# Altium schematic sheet revisies.SchDoc
size A3; ApprovedBy: CdB; CheckedBy: CdB; DrawnBy: RT; Engineer: CdB; Organization: Faber Electronics B.V.; Address1: Th. Dobbeweg 1,; Address2: 6883 GN Velp,; Address3: Netherlands; Address4: T: 026-38 46 800; DocumentNumber: 6; Revision: 2.1.3; SheetNumber: 6; SheetTotal: 6; Status: Final
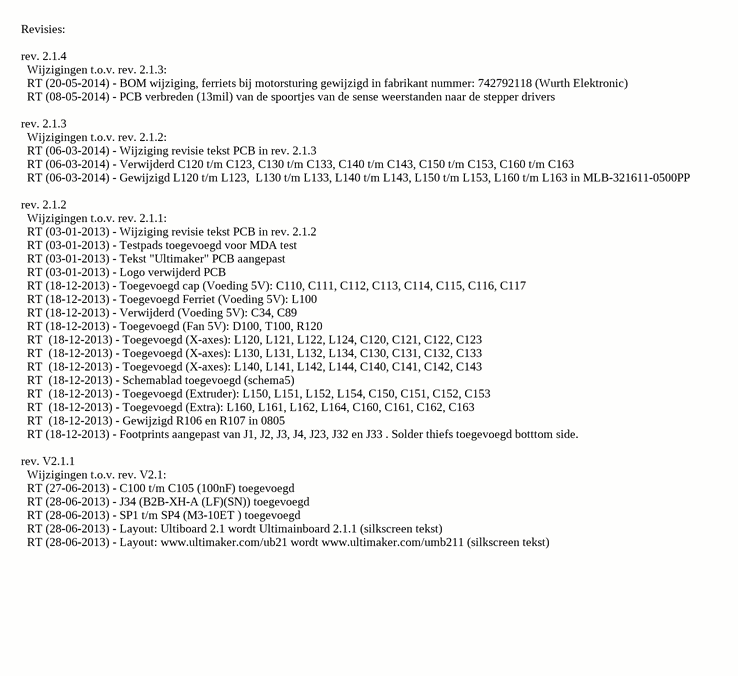
[diagram p0: revisies.SchDoc]

## Notes on the sheet
- Revisies:
  rev. 2.1.4
  Wijzigingen t.o.v. rev. 2.1.3:
  RT (20-05-2014) - BOM wijziging, ferriets bij motorsturing gewijzigd in fabrikant nummer: 742792118 (Wurth Elektronic)
  RT (08-05-2014) - PCB verbreden (13mil) van de spoortjes van de sense weerstanden naar de stepper drivers
  rev. 2.1.3
  Wijzigingen t.o.v. rev. 2.1.2:
  RT (06-03-2014) - Wijziging revisie tekst PCB in rev. 2.1.3
  RT (06-03-2014) - Verwijderd C120 t/m C123, C130 t/m C133, C140 t/m C143, C150 t/m C153, C160 t/m C163
  RT (06-03-2014) - Gewijzigd L120 t/m L123,  L130 t/m L133, L140 t/m L143, L150 t/m L153, L160 t/m L163 in MLB-321611-0500PP
  rev. 2.1.2
  Wijzigingen t.o.v. rev. 2.1.1:
  RT (03-01-2013) - Wijziging revisie tekst PCB in rev. 2.1.2
  RT (03-01-2013) - Testpads toegevoegd voor MDA test
  RT (03-01-2013) - Tekst "Ultimaker" PCB aangepast
  RT (03-01-2013) - Logo verwijderd PCB
  RT (18-12-2013) - Toegevoegd cap (Voeding 5V): C110, C111, C112, C113, C114, C115, C116, C117
  RT (18-12-2013) - Toegevoegd Ferriet (Voeding 5V): L100
  RT (18-12-2013) - Verwijderd (Voeding 5V): C34, C89
  RT (18-12-2013) - Toegevoegd (Fan 5V): D100, T100, R120
  RT  (18-12-2013) - Toegevoegd (X-axes): L120, L121, L122, L124, C120, C121, C122, C123
  RT  (18-12-2013) - Toegevoegd (X-axes): L130, L131, L132, L134, C130, C131, C132, C133
  RT  (18-12-2013) - Toegevoegd (X-axes): L140, L141, L142, L144, C140, C141, C142, C143
  RT  (18-12-2013) - Schemablad toegevoegd (schema5)
  RT  (18-12-2013) - Toegevoegd (Extruder): L150, L151, L152, L154, C150, C151, C152, C153
  RT  (18-12-2013) - Toegevoegd (Extra): L160, L161, L162, L164, C160, C161, C162, C163
  RT  (18-12-2013) - Gewijzigd R106 en R107 in 0805
  RT (18-12-2013) - Footprints aangepast van J1, J2, J3, J4, J23, J32 en J33 . Solder thiefs toegevoegd botttom side.
  rev. V2.1.1
  Wijzigingen t.o.v. rev. V2.1:
  RT (27-06-2013) - C100 t/m C105 (100nF) toegevoegd
  RT (28-06-2013) - J34 (B2B-XH-A (LF)(SN)) toegevoegd
  RT (28-06-2013) - SP1 t/m SP4 (M3-10ET ) toegevoegd
  RT (28-06-2013) - Layout: Ultiboard 2.1 wordt Ultimainboard 2.1.1 (silkscreen tekst)
  RT (28-06-2013) - Layout: www.ultimaker.com/ub21 wordt www.ultimaker.com/umb211 (silkscreen tekst)
- Project name
- Document Name
- Revision:
- Date:
- Status:
- Engineer:
- Drawing by:
- Time:
- Approved By:
- Checked By:
- Date of approval:
- Sheet
- of
- Size:
- A3
- File:
- F: 026-36 48 244